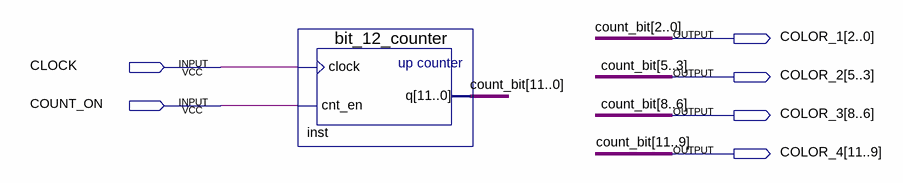
[diagram p0: schematic sheet]
// Quartus schematic rng.bdf as structural Verilog: 1 symbols, 6 pins
module rng (
  input  CLOCK,
  input  COUNT_ON,
  output [2:0] COLOR_1,
  output [5:3] COLOR_2,
  output [8:6] COLOR_3,
  output [11:9] COLOR_4
);

  bit_12_counter inst (.clock(CLOCK), .cnt_en(COUNT_ON), .q({COLOR_4, COLOR_3, COLOR_2, COLOR_1}));

  // Other names for the same wires on the sheet: count_bit[11:0] = {COLOR_4, COLOR_3, COLOR_2, COLOR_1}
endmodule
